# EAGLE design Stethoscope v1.0 (EAGLE 7.7.0)
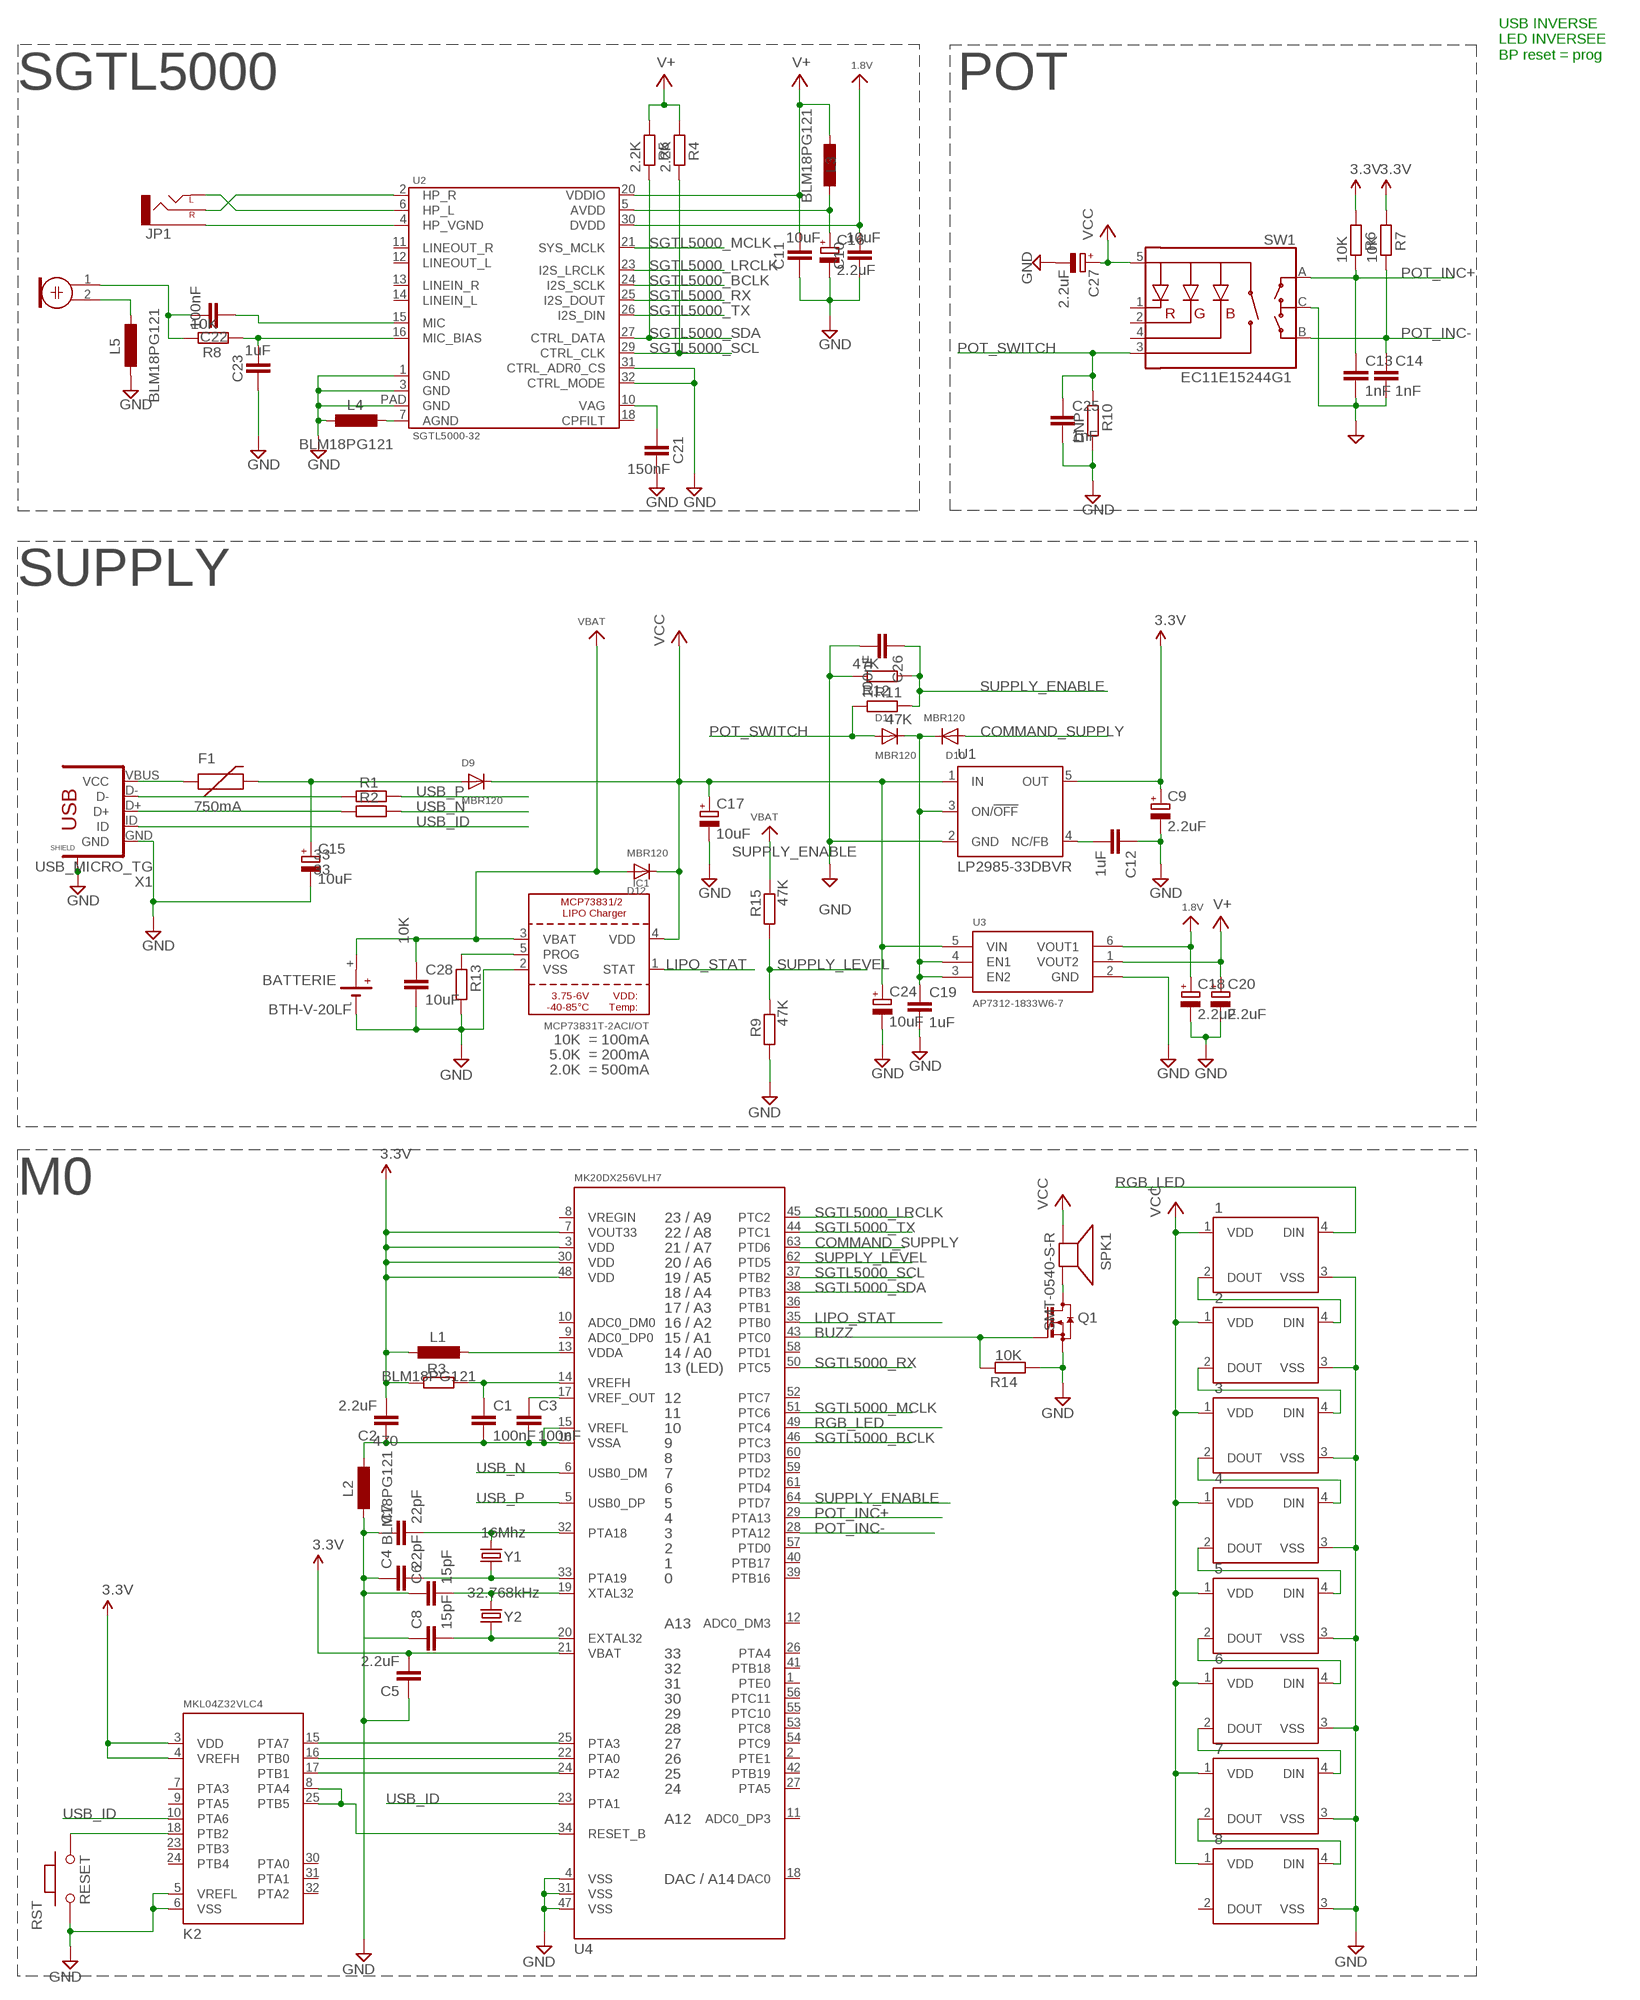
[diagram p0: schematic, sheet 1]

## Parts
1  WS2812B  [WS2812B]
2  WS2812B  [WS2812B]
3  WS2812B  [WS2812B]
4  WS2812B  [WS2812B]
5  WS2812B  [WS2812B]
6  WS2812B  [WS2812B]
7  WS2812B  [WS2812B]
8  WS2812B  [WS2812B]
BATTERIE  BTH-V-20LF  B1  [3V_BAT_HOLDER]
C1  100nF  C-EUC0603  [C0603]
C2  2.2uF  C-EUC0603  [C0603]
C3  100nF  C-EUC0603  [C0603]
C4  22pF  C-EUC0603  [C0603]
C5  2.2uF  C-EUC0603  [C0603]
C6  15pF  C-EUC0603  [C0603]
C7  22pF  C-EUC0603  [C0603]
C8  15pF  C-EUC0603  [C0603]
C9  2.2uF  CPOL-EUC0805POL  [C0805POL]
C10  10uF  C-EUC0805  [C0805]
C11  10uF  C-EUC0805  [C0805]
C12  1uF  C-EUC0603  [C0603]
C13  1nF  C-EUC0603  [C0603]
C14  1nF  C-EUC0603  [C0603]
C15  10uF  CPOL-EUC0805POL  [C0805POL]
C16  2.2uF  CPOL-EUC0805POL  [C0805POL]
C17  10uF  CPOL-EUC0805POL  [C0805POL]
C18  2.2uF  CPOL-EUC0805POL  [C0805POL]
C19  1uF  C-EUC0603  [C0603]
C20  2.2uF  CPOL-EUC0805POL  [C0805POL]
C21  150nF  C-EUC0805  [C0805]
C22  100nF  C-EUC0805  [C0805]
C23  1uF  C-EUC0805  [C0805]
C24  10uF  CPOL-EUC0805POL  [C0805POL]
C25  1nF  C-EUC0603  [C0603]
C26  100nF  C-EUC0603  [C0603]
C27  2.2uF  CPOL-EUC0805POL  [C0805POL]
C28  10uF  C-EUC1206  [C1206]
D9  MBR120  DIODESOD-323F  [SOD-323F]
D10  MBR120  DIODESOD-323F  [SOD-323F]
D11  MBR120  DIODESOD-323F  [SOD-323F]
D12  MBR120  DIODESOD-323F  [SOD-323F]
F1  750mA  PTC0603  [0603]
IC1  MCP73831T-2ACI/OT  MCP73831/2  [SOT23-5]
JP1  AUDIO-JACK1:1  [STEREOJACK2.5MM]
K2  MKL04Z32VLC4  [LQFP32-08]
L1  BLM18PG121  L-EUL0603  [L0603]
L2  BLM18PG121  L-EUL0603  [L0603]
L3  BLM18PG121  L-EUL0603  [L0603]
L4  BLM18PG121  L-EUL0603  [L0603]
L5  BLM18PG121  L-EUL0603  [L0603]
M1  ELECTRET_MICROPHON-F6050AP  [F6050AP]
Q1  BSS123  [SOT23]
R1  33  R-EU_R0603  [R0603]
R2  33  R-EU_R0603  [R0603]
R3  470  R-EU_R0603  [R0603]
R4  2.2K  R-EU_R0603  [R0603]
R5  2.2K  R-EU_R0603  [R0603]
R6  10K  R-EU_R0603  [R0603]
R7  10K  R-EU_R0603  [R0603]
R8  10K  R-EU_R0603  [R0603]
R9  47K  R-EU_R0603  [R0603]
R10  DNP  R-EU_R0603  [R0603]
R11  47K  R-EU_R0603  [R0603]
R12  47K  R-EU_R0603  [R0603]
R13  10K  R-EU_R0603  [R0603]
R14  10K  R-EU_R0603  [R0603]
R15  47K  R-EU_R0603  [R0603]
RST  RESET  PB157  [157SW]
SPK1  SMT-0540-S-R  [SMT-0540-S-R]
SW1  EC11E15244G1  ENCODER_RGB_CAKIT  [ENCODER_LED_3_KIT]
U1  LP2985-33DBVR  LP2985-XXDBVR33  [SOT23-DBV]
U2  SGTL5000-32  [QFN-32-5MM]
U3  AP7312-1833W6-7  VREG_SOT23-6_DUALAP7312  [SOT23-6]
U4  MK20DX256VLH7  [LQFP64-05]
X1  USB_MICRO_TG  [USB_MICRO_TG]
Y1  16Mhz  CRYSTAL3.2X1.5MM  [CRYSTAL-SMD-3.2X1.5MM]
Y2  32.768kHz  CRYSTAL3.2X1.5MM  [CRYSTAL-SMD-3.2X1.5MM]

## Nets
1.8V: C10.2 C18.SMD+(+) U2.30(DVDD) U3.6(VOUT1)
3.3V: C2.2 C5.2 C9.SMD+(+) K2.3(VDD) K2.4(VREFH) L1.2 R3.2 R6.2 R7.2 U1.5(OUT) U4.3(VDD) U4.7(VOUT33) U4.21(VBAT) U4.30(VDD) U4.48(VDD)
BUZZ: Q1.1(G) R14.2 U4.43(PTC0)
COMMAND_SUPPLY: D10.A U4.63(PTD6)
COMMAND_SUPPLY2: C19.1 D10.C D11.C U1.3(ON/!OFF) U3.3(EN2) U3.4(EN1)
GND: 1.3(VSS) 2.3(VSS) 3.3(VSS) 4.3(VSS) 5.3(VSS) 6.3(VSS) 7.3(VSS) 8.3(VSS) BATTERIE.- C4.1 C5.1 C6.1 C7.1 C8.1 C9.SMD-(-) C10.1 C11.1 C12.1 C13.2 C14.2 C15.SMD-(-) C16.SMD-(-) C17.SMD-(-) C18.SMD-(-) C19.2 C20.SMD-(-) C21.2 C23.1 C24.SMD-(-) C25.2 C26.2 C27.SMD-(-) C28.2 IC1.2(VSS) K2.5(VREFL) K2.6(VSS) L2.2 L4.2 L5.2 Q1.2(S) R9.1 R10.1 R12.2 R13.1 R14.1 RST.1 SW1.C U1.2(GND) U2.1(GND) U2.3(GND) U2.31(CTRL_ADR0_CS) U2.32(CTRL_MODE) U2.PAD(GND) U3.2(GND) U4.4(VSS) U4.31(VSS) U4.47(VSS) X1.GND X1.SHIELD X1.SHIELD2(SHIELD1) X1.SHIELD3(SHIELD2) X1.SHIELD4(SHIELD3) X1.SHIELD5(SHIELD4) X1.SHIELD6(SHIELD5) X1.SHIELD7(SHIELD6) X1.SHIELD8(SHIELD7)
LIPO_STAT: IC1.1(STAT) U4.35(PTB0)
N$1: C16.SMD+(+) L3.1 U2.5(AVDD)
N$2: L1.1 U4.13(VDDA)
N$3: K2.8(PTA4) K2.25(PTB5) U4.34(RESET_B)
N$4: C21.1 U2.10(VAG)
N$5: C6.2 U4.19(XTAL32) Y2.P$2
N$6: C15.SMD+(+) D9.A F1.2
N$7: C23.2 R8.2 U2.16(MIC_BIAS)
N$8: C22.1 U2.15(MIC)
N$9: JP1.5(SLEEVE) U2.4(HP_VGND)
N$10: JP1.1(LEFT) U2.6(HP_L)
N$11: JP1.4(RIGHT) U2.2(HP_R)
N$13: C8.2 U4.20(EXTAL32) Y2.P$1
N$14: C22.2 M1.1 R8.1
N$15: R1.2 X1.D-
N$16: R2.2 X1.D+
N$17: L5.1 M1.2
N$19: IC1.5(PROG) R13.2
N$20: L4.1 U2.7(AGND)
N$21: C12.2 U1.4(NC/FB)
N$22: C7.2 U4.32(PTA18) Y1.P$2
N$23: C4.2 U4.33(PTA19) Y1.P$1
N$24 [usbvcc]: F1.1 X1.VBUS(VCC)
N$26: C1.1 R3.1 U4.14(VREFH)
N$28: C1.2 C2.1 C3.2 L2.1 U4.15(VREFL) U4.16(VSSA)
N$29: C3.1 U4.17(VREF_OUT)
N$30: K2.15(PTA7) U4.25(PTA3)
N$31: K2.16(PTB0) U4.22(PTA0)
N$32: K2.17(PTB1) U4.24(PTA2)
N$34: K2.18(PTB2) RST.2
N$36: 2.2(DOUT) 3.4(DIN)
N$37: 3.2(DOUT) 4.4(DIN)
N$38: 4.2(DOUT) 5.4(DIN)
N$41: 5.2(DOUT) 6.4(DIN)
N$42: 6.2(DOUT) 7.4(DIN)
N$44: Q1.3(D) SPK1.+(-)
N$46: 7.2(DOUT) 8.4(DIN)
N$270: 1.2(DOUT) 2.4(DIN)
POT_INC+: C13.1 R6.1 SW1.A U4.29(PTA13)
POT_INC-: C14.1 R7.1 SW1.B U4.28(PTA12)
POT_SWITCH: C25.1 D11.A R10.2 R11.1 SW1.3(SW)
RGB_LED: 1.4(DIN) U4.49(PTC4)
SGTL5000_BCLK: U2.24(I2S_SCLK) U4.46(PTC3)
SGTL5000_LRCLK: U2.23(I2S_LRCLK) U4.45(PTC2)
SGTL5000_MCLK: U2.21(SYS_MCLK) U4.51(PTC6)
SGTL5000_RX: U2.25(I2S_DOUT) U4.50(PTC5)
SGTL5000_SCL: R4.1 U2.29(CTRL_CLK) U4.37(PTB2)
SGTL5000_SDA: R5.1 U2.27(CTRL_DATA) U4.38(PTB3)
SGTL5000_TX: U2.26(I2S_DIN) U4.44(PTC1)
SUPPLY_ENABLE: C26.1 R11.2 R12.1 U4.64(PTD7)
SUPPLY_LEVEL: R9.2 R15.1 U4.62(PTD5)
USB_ID: K2.10(PTA6) U4.23(PTA1) X1.ID
USB_N: R2.1 U4.6(USB0_DM)
USB_P: R1.1 U4.5(USB0_DP)
V+: C11.2 C20.SMD+(+) L3.2 R4.2 R5.2 U2.20(VDDIO) U3.1(VOUT2)
VBAT: BATTERIE.+ C28.1 D12.A IC1.3(VBAT) R15.2
VCC: 1.1(VDD) 2.1(VDD) 3.1(VDD) 4.1(VDD) 5.1(VDD) 6.1(VDD) 7.1(VDD) 8.1(VDD) C17.SMD+(+) C24.SMD+(+) C27.SMD+(+) D9.C D12.C IC1.4(VDD) SPK1.-(+) SW1.5(+) U1.1(IN) U3.5(VIN)
Unconnected: 8.2(DOUT) BATTERIE.1+(+) K2.7(PTA3) K2.9(PTA5) K2.23(PTB3) K2.24(PTB4) K2.30(PTA0) K2.31(PTA1) K2.32(PTA2) SW1.1(-R) SW1.2(-G) SW1.4(-B) U2.11(LINEOUT_R) U2.12(LINEOUT_L) U2.13(LINEIN_R) U2.14(LINEIN_L) U2.18(CPFILT) U4.1(PTE0) U4.2(PTE1) U4.8(VREGIN) U4.9(ADC0_DP0) U4.10(ADC0_DM0) U4.11(ADC0_DP3) U4.12(ADC0_DM3) U4.18(DAC0) U4.26(PTA4) U4.27(PTA5) U4.36(PTB1) U4.39(PTB16) U4.40(PTB17) U4.41(PTB18) U4.42(PTB19) U4.52(PTC7) U4.53(PTC8) U4.54(PTC9) U4.55(PTC10) U4.56(PTC11) U4.57(PTD0) U4.58(PTD1) U4.59(PTD2) U4.60(PTD3) U4.61(PTD4)

## Notes on the sheet
- USB INVERSE
  LED INVERSEE
  BP reset = prog
- SGTL5000 | POT
- SUPPLY
- 10K  = 100mA
- 5.0K  = 200mA
- 2.0K  = 500mA
- M0
- 23 / A9
- 22 / A8
- 21 / A7
- 20 / A6
- 19 / A5
- 18 / A4
- 17 / A3
- 16 / A2
- 15 / A1
- 14 / A0
- 13 (LED)
- 12
- 11
- 10
- 9
- 8
- 7
- 6
- 5
- 4
- 3
- 2
- 1
- 0
- A13
- 33
- 32
- 31
- 30
- 29
- 28
- 27
- 26
- 25
- 24
- A12
- DAC / A14

## Library data of the parts
1-8 = SparkFun-LED:WS2812B: WS2812B - Intelligent control LED integrated light source Technical Specifications: Power Supply Voltage (VDD): 3.5 to 5.3 V Input Voltage (VI): -0.5 to VDD+0.5 V Operating Junction Temperature (Topt): -25°C to +80°C Storage Temperature Range (Tstg): -55°C to +150°C
BATTERIE = DOUBLE-SIDE:B: LI BATTERY Varta
C1-C8 C10-C14 C19 C21-C23 C25 C26 = rcl:C-EU: CAPACITOR, European symbol
C9 C15-C18 C20 C24 C27 = rcl:CPOL-EU: POLARIZED CAPACITOR, European symbol
C28 = resistor:C-EU: CAPACITOR, European symbol
D9-D12 = adafruit:DIODE: Diode SMADIODE - SMA Surface Mount Package 20V 1A Schottky Diode Digikey: 641-1014-6-ND DO-1N4148 - Through Hole Small Current Diode SOD-123 20V 1 A (.5mV Vf) Schottky Diode - Digikey: MBRX120TPMSCT-ND SOD-323 10V 570mA (.38mV Vf, 3ns) Schottky Diode - Digikey: ZLLS410CT-ND SOD-523 30V 30mA Schottky Diode (RB751S-40TE61) - Digikey: RB751S-40TE61CT-ND SOT23-R/W - SOT23 Package (R = Solder Paste/Reflow Ovens, W = Hand-Soldering) BAT54Film 40V 300mA - Digikey: 497-7162-1-ND
F1 = SparkFun-PowerIC:PTC: Resettable Fuse PTC Resettable Fuse. Spark Fun Electronics SKU : COM-08357
IC1 = microbuilder:MCP73831/2: MCP73831/2 LIPO Charger VDD: 3.75 - 6V Temp -40 - 85°C Programmable Charge Rate: 15-500mA NOTE: STAT is a tri-state logic output on the MCP73831 and an open-drain output on the MCP73832. SOT23-5 with 4.2V output and tri-state logic on STAT = MCP73831T-2ACI/OT
JP1 = SparkFun-Connectors:AUDIO-JACK: 3.5mm Audio Jack Simple 3.5mm common PCB mount audio jack. Variant PTH is our storefront SKU PRT-08032
K2 = t32_ref:MKL04Z32VLC4; DESC: MKL04Z32VLC4 (preprogrammed); MF: PJRC; MPN: IC_MKL04Z32_TQFP32; PACKAGE: LQFP-32; TYPE: Microcontroller
L1-L5 = rcl-2:L-EU: INDUCTOR, European symbol
M1 = microphon:ELECTRET_MICROPHON-: Electret Condenser Microphone
Q1 = transistor-small-signal:BSS123: N-CHANNEL MOS FET
R1-R3 R9 R11-R13 R15 = resistor:R-EU_: RESISTOR, European symbol
R4-R8 R10 R14 = rcl:R-EU_: RESISTOR, European symbol
RST = MySMD:PB157
SPK1 = adafruit:SMT-0540-S-R: SMT-0549-S-R Small surface-mount magnetic buzzer
SW1 = SparkFun-Electromechanical:ENCODER_RGB_CA: Illuminated Rotary Encoder w/ RGB LED and select switch EC12PLRGBSDVBF-D: http://top-up.so-buy.com/front/bin/ptdetail.phtml?Part=EC12PLRGBSDVBF-D
U1 = SmartPrj:LP2985-XXDBVR: ULTRALOW-POWER 50-mA LOW-DROPOUT LINEAR REGULATORS 50-mA Low-Dropout Regulator Source: http://focus.ti.com/lit/ds/symlink/tps77001.pdf
U2 = Freescale:SGTL5000-32
U3 = microbuilder:VREG_SOT23-6_DUAL: Dual Output SOT23-6 Linear Regulators Diodes Inc. AP7312 - Dual 150mA LDO Linear Regulator 0.2V dropout, 150mA output, 2-6V Input AP7312-1833W6-7 - 1.8V/3.3V SOT23-6 (Digikey: AP7312-1833W6-7DICT-ND) MIC5320 - Dual 150mA ULDO Linear Regulator Ultra-low 35mV dropout at 150mA, 2.3-5.5V Input 3.3V/1.8V SOT23-6 (Digikey: 576-1658-1-ND) 3.3V/1.5V SOT23-6 (Digikey: 576-3483-1-ND)
U4 = t32_ref:MK20DX256VLH7; DESC: MK20DX256VLH7; MF: NXP; MPN: MK20DX256VLH7; OC_MOUSER: 841-MK20DX256VLH7; PACKAGE: LQFP-64; TYPE: Microcontroller
X1 = CIC-IT:USB_MICRO_TG
Y1 Y2 = samd21-temp:CRYSTAL: Various standard crystals. Proven footprints.; PROD_ID: XTAL-13062

## Net classes
1 Power: width 0.254 mm, clearance 0.152 mm
2 gnd: width 0.305 mm, drill 0.559 mm, clearance 0.254 mm
3 usbvcc: width 0.254 mm, drill 0.254 mm, clearance 0.203 mm

## Board
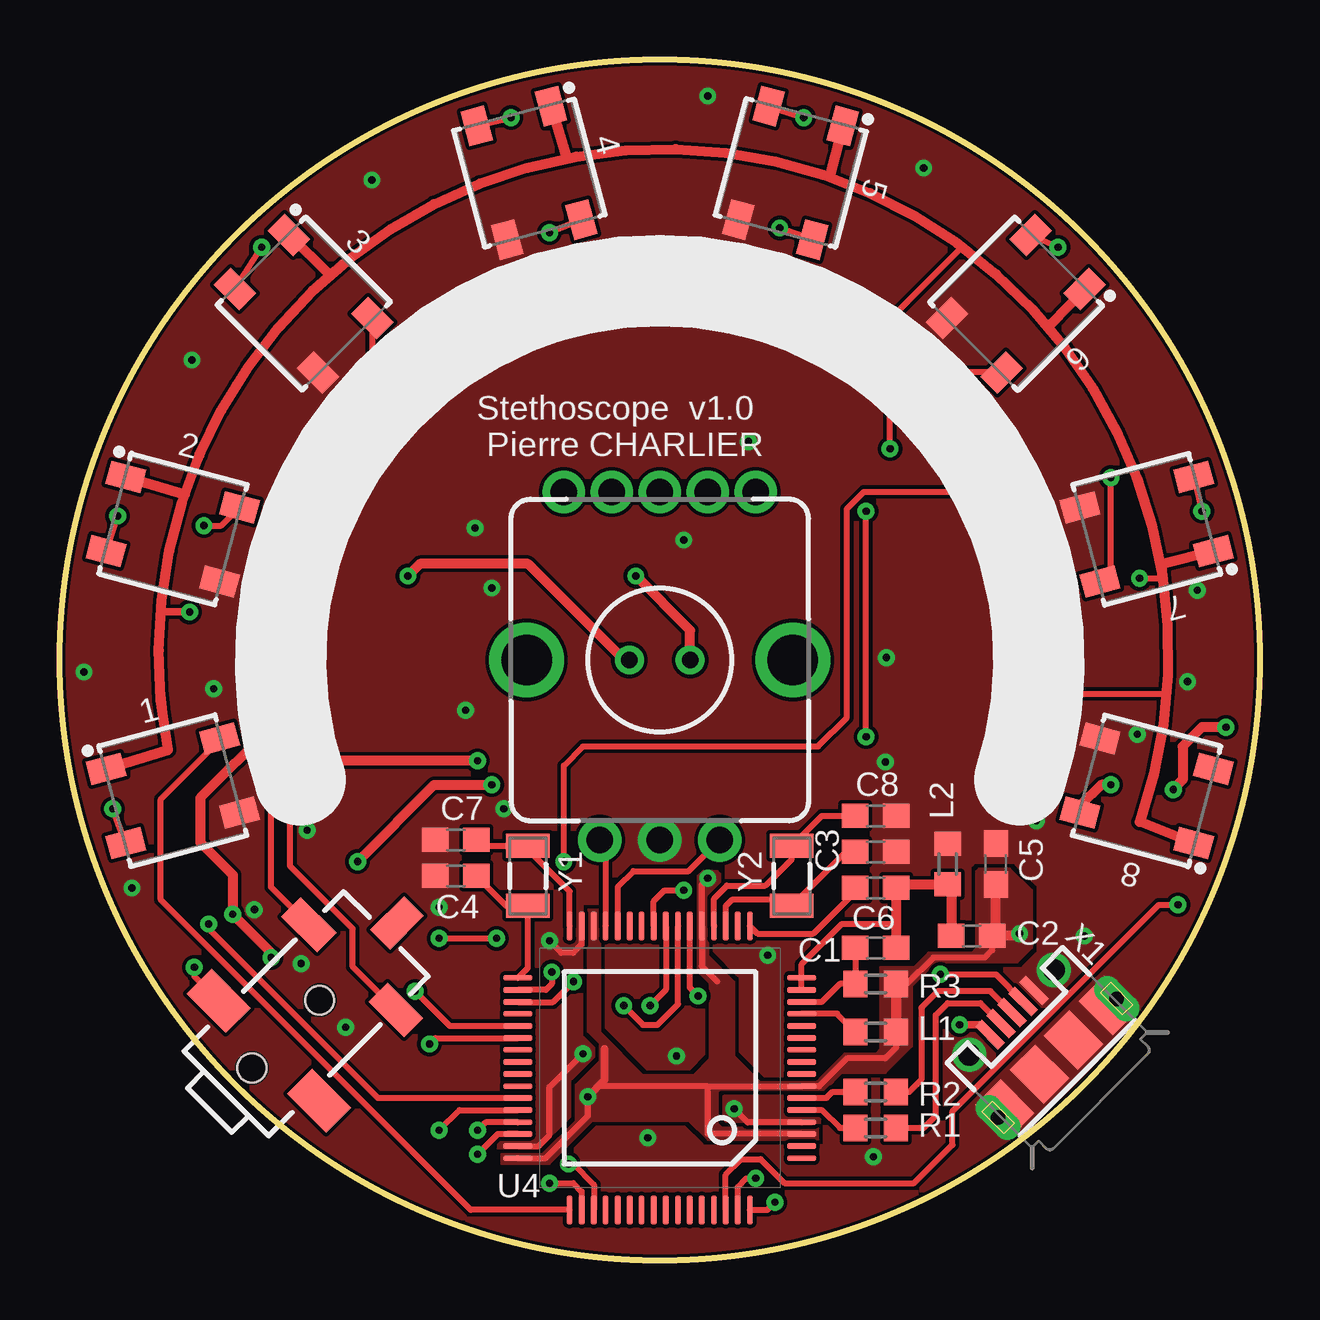
[diagram p1: board, top side]
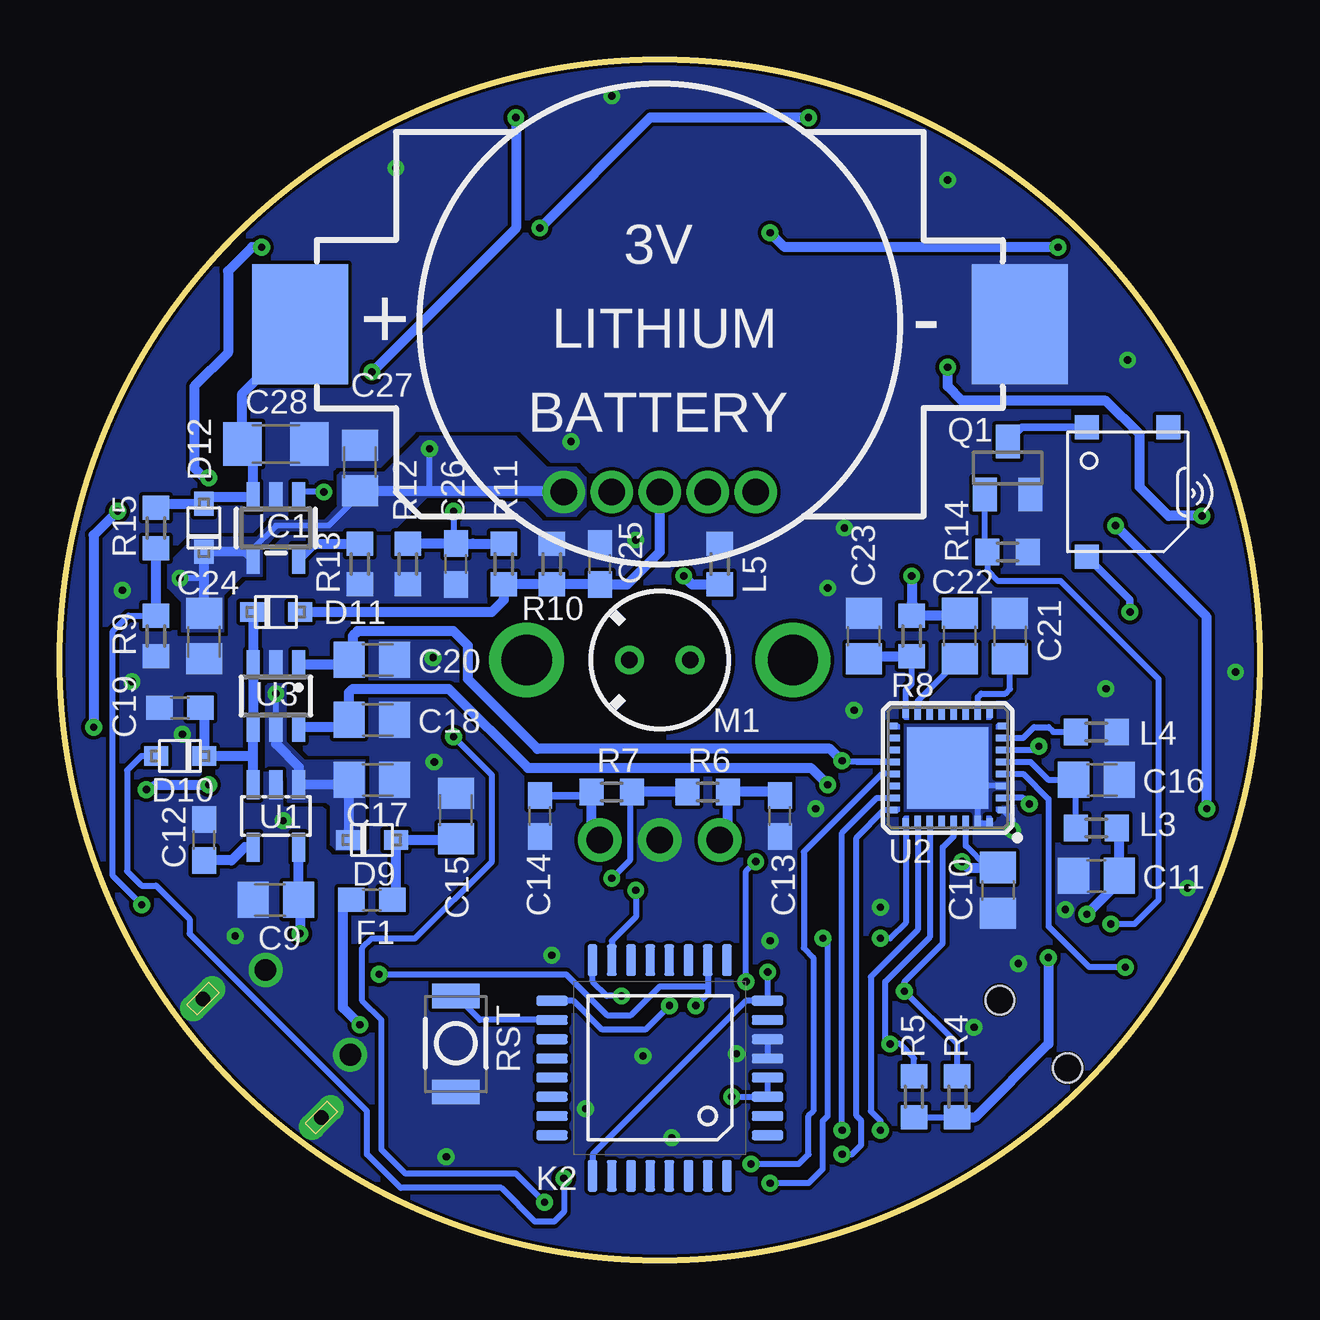
[diagram p2: board, bottom side, seen from below]

Size 50 x 50 mm. Coordinates in mm from the lower left corner, seen from the top.
Outline: circle at 25,25 radius 25
Copper layers (1*16): Top 0.035mm / dielectric 1.5mm / Bottom 0.035mm
Design rules "default *": minimum track width 0.2mm, minimum drill 0.3mm, track to track 6mil, track to pad 6mil, pad to pad 6mil, via to via 8mil, smd to smd 4mil, copper to edge 0.1mm, drill to drill 0.2mm, minimum pad ring 10mil, minimum via ring 8mil, stop-mask expansion 4mil, vias tented up to drill 20mil, thermal gap 10mil

### Footprints (pad centres in the part's own frame; a part is rotated, then mirrored left to right if it is on the bottom)
WS2812B = smd 1.5 x 1: 1 -2.45,1.6; 2 -2.45,-1.6; 3 2.45,-1.6; 4 2.45,1.6
3V_BAT_HOLDER = smd 2 x 2: 1+ -15,0 | smd 4 x 5: + -15,0; - 15,0
C0603 = smd 1.1 x 1: 1 -0.85,0; 2 0.85,0
C0805POL = smd 1.3 x 1.5: SMD+ -0.95,0; SMD- 0.95,0
C0805 = smd 1.3 x 1.5: 1 -0.95,0; 2 0.95,0
C1206 = smd 1.6 x 1.8: 1 -1.4,0; 2 1.4,0
SOD-323F = smd 1 x 0.8: A -1,0; C 1,0
0603 = smd 1.1 x 1: 1 -0.85,0; 2 0.85,0
SOT23-5 = smd 0.55 x 1.2: 1 -0.95,-1.3; 2 0,-1.3; 3 0.95,-1.3; 4 0.95,1.3; 5 -0.95,1.3
STEREOJACK2.5MM = smd 1.144 x 2.1: 1 5.898,2.54 | smd 1.998 x 1.17: 3 8.55,0 | smd 1.119 x 2.1: 4 5.949,-2.54 | smd 1.467 x 2.3: 5 1,2.952; A 1.016,-2.952 | hole 1.2: 0,0; 4,0
LQFP32-08 = smd 1.3 x 0.4: 1 -4.493,2.8; 2 -4.493,2; 3 -4.493,1.2; 4 -4.493,0.4; 5 -4.493,-0.4; 6 -4.493,-1.2; 7 -4.493,-2; 8 -4.493,-2.8; 17 4.493,-2.8; 18 4.493,-2; 19 4.493,-1.2; 20 4.493,-0.4; 21 4.493,0.4; 22 4.493,1.2; 23 4.493,2; 24 4.493,2.8 | smd 0.4 x 1.3: 9 -2.8,-4.493; 10 -2,-4.493; 11 -1.2,-4.493; 12 -0.4,-4.493; 13 0.4,-4.493; 14 1.2,-4.493; 15 2,-4.493; 16 2.8,-4.493; 25 2.8,4.493; 26 2,4.493; 27 1.2,4.493; 28 0.4,4.493; 29 -0.4,4.493; 30 -1.2,4.493; 31 -2,4.493; 32 -2.8,4.493
L0603 = smd 1 x 1.1: 1 -0.85,0; 2 0.85,0
F6050AP = drill 0.7 pad 1.2: 1 0,1.27; 2 0,-1.27
SOT23 = smd 1 x 1.4: 1 -0.95,-1.1; 2 0.95,-1.1; 3 0,1.1
R0603 = smd 1 x 1.1: 1 -0.85,0; 2 0.85,0
157SW = smd 1.016 x 1.981: 1 0,0; 2 4,0
SMT-0540-S-R = smd 1 x 1: + 1.7,-2.7; - 1.7,2.7; M -1.7,-2.7
ENCODER_LED_3_KIT = drill 1.1 pad 1.778: 1 -4,7; 2 -2,7; 3 0,7; 4 2,7; 5 4,7 | drill 1.1 pad 1.8: A -2.5,-7.5; B 2.5,-7.5; C 0,-7.5 | drill 2.1: M1 -5.55,0; M2 5.55,0
SOT23-DBV = smd 0.55 x 1.2: 1 -0.95,-1.3; 2 0,-1.3; 3 0.95,-1.3; 4 0.95,1.3; 5 -0.95,1.3
QFN-32-5MM = smd 0.4 x 0.29: 1 -2.3,1.75; 8 -2.3,-1.75; 17 2.3,-1.75; 24 2.3,1.75 | smd 0.5 x 0.29: 2 -2.25,1.25; 3 -2.25,0.75; 4 -2.25,0.25; 5 -2.25,-0.25; 6 -2.25,-0.75; 7 -2.25,-1.25; 18 2.25,-1.25; 19 2.25,-0.75; 20 2.25,-0.25; 21 2.25,0.25; 22 2.25,0.75; 23 2.25,1.25 | smd 0.29 x 0.4: 9 -1.75,-2.3; 16 1.75,-2.3; 25 1.75,2.3; 32 -1.75,2.3 | smd 0.29 x 0.5: 10 -1.25,-2.25; 11 -0.75,-2.25; 12 -0.25,-2.25; 13 0.25,-2.25; 14 0.75,-2.25; 15 1.25,-2.25; 26 1.25,2.25; 27 0.75,2.25; 28 0.25,2.25; 29 -0.25,2.25; 30 -0.75,2.25; 31 -1.25,2.25 | smd 3.4 x 3.4: PAD 0,0
SOT23-6 = smd 0.55 x 1.2: 1 -0.95,-1.3; 2 0,-1.3; 3 0.95,-1.3; 4 0.95,1.3; 5 0,1.3; 6 -0.95,1.3
LQFP64-05 = smd 1.2 x 0.25: 1 -5.915,3.759; 2 -5.915,3.251; 3 -5.915,2.743; 4 -5.915,2.261; 5 -5.915,1.753; 6 -5.915,1.245; 7 -5.915,0.762; 8 -5.915,0.254; 9 -5.915,-0.254; 10 -5.915,-0.762; 11 -5.915,-1.245; 12 -5.915,-1.753; 13 -5.915,-2.261; 14 -5.915,-2.743; 15 -5.915,-3.251; 16 -5.915,-3.759; 33 5.915,-3.759; 34 5.915,-3.251; 35 5.915,-2.743; 36 5.915,-2.261; 37 5.915,-1.753; 38 5.915,-1.245; 39 5.915,-0.762; 40 5.915,-0.254; 41 5.915,0.254; 42 5.915,0.762; 43 5.915,1.245; 44 5.915,1.753; 45 5.915,2.261; 46 5.915,2.743; 47 5.915,3.251; 48 5.915,3.759 | smd 0.25 x 1.2: 17 -3.759,-5.915; 18 -3.251,-5.915; 19 -2.743,-5.915; 20 -2.261,-5.915; 21 -1.753,-5.915; 22 -1.245,-5.915; 23 -0.762,-5.915; 24 -0.254,-5.915; 25 0.254,-5.915; 26 0.762,-5.915; 27 1.245,-5.915; 28 1.753,-5.915; 29 2.261,-5.915; 30 2.743,-5.915; 31 3.251,-5.915; 32 3.759,-5.915; 49 3.759,5.915; 50 3.251,5.915; 51 2.743,5.915; 52 2.261,5.915; 53 1.753,5.915; 54 1.245,5.915; 55 0.762,5.915; 56 0.254,5.915; 57 -0.254,5.915; 58 -0.762,5.915; 59 -1.245,5.915; 60 -1.753,5.915; 61 -2.261,5.915; 62 -2.743,5.915; 63 -3.251,5.915; 64 -3.759,5.915
USB_MICRO_TG = smd 1.35 x 0.4: D+ 1.148,0.006; D- 1.148,0.656; GND 1.148,-1.294; ID 1.148,-0.644; VBUS 1.148,1.306 | smd 2 x 1.5: SHIELD -1.482,3.056; SHIELD2 -1.482,1.006; SHIELD3 -1.482,-1.004; SHIELD4 -1.482,-3.044 | drill 0.6 pad 0.95 long: SHIELD5 -1.532,3.506; SHIELD6 -1.532,-3.484 | drill 0.9 pad 1.422: SHIELD7 1.168,2.506; SHIELD8 1.171,-2.486
CRYSTAL-SMD-3.2X1.5MM = smd 1 x 1.8: P$1 -1.25,0; P$2 1.25,0

### Placement (x,y rotation side)
1  4.7,19.55 15 top
2  4.7,30.45 345 top
3  10.15,39.85 315 top
4  19.55,45.3 285 top
5  30.45,45.3 255 top
6  39.85,39.85 225 top
7  45.3,30.45 195 top
8  45.3,19.55 165 top
BATTERIE  25,39 0 bottom
C1  34,13 0 top
C2  38,13.5 0 top
C3  34,15.5 0 top
C4  16.5,16 0 top
C5  39,16.5 270 top
C6  34,17 180 top
C7  16.5,17.5 0 top
C8  34,18.5 180 top
C9  41,15 180 bottom
C10  10.9,15.4 90 bottom
C11  6.8,16 0 bottom
C12  44,17.5 270 bottom
C13  20,18.5 270 bottom
C14  30,18.5 270 bottom
C15  33.5,18.5 90 bottom
C16  6.8,20 0 bottom
C17  37,20 0 bottom
C18  37,22.5 0 bottom
C19  45,23 180 bottom
C20  37,25 0 bottom
C21  10.4,26 90 bottom
C22  12.5,26 90 bottom
C23  16.5,26 270 bottom
C24  44,26 270 bottom
C25  27.5,29 90 bottom
C26  33.5,29 270 bottom
C27  37.5,33 90 bottom
C28  41,34 0 bottom
D9  37,17.5 180 bottom
D10  45,21 0 bottom
D11  41,27 180 bottom
D12  44,30.5 270 bottom
F1  37,15 0 bottom
IC1  41,30.5 180 bottom
JP1  8,8 45 top
K2  25,8 180 bottom
L1  34,9.5 0 top
L2  37,16.5 90 top
L3  6.8,18 0 bottom
L4  6.8,22 0 bottom
L5  22.5,29 90 bottom
M1  25,25 270 bottom
Q1  10.5,33 0 bottom
R1  34,5.5 0 top
R2  34,7 0 top
R3  34,11.5 0 top
R4  12.6,6.8 270 bottom
R5  14.4,6.8 270 bottom
R6  23,19.5 180 bottom
R7  27,19.5 0 bottom
R8  14.5,26 270 bottom
R9  46,26 90 bottom
R10  29.5,29 270 bottom
R11  31.5,29 90 bottom
R12  35.5,29 270 bottom
R13  37.5,29 90 bottom
R14  10.5,29.5 180 bottom
R15  46,30.5 90 bottom
RST  33.5,7 90 bottom
SPK1  5.5,32 180 bottom
SW1  25,25 0 top
U1  41,18.5 180 bottom
U2  13,20.5 180 bottom
U3  41,23.5 180 bottom
U4  25,8 180 top
X1  40.5,9.5 135 top
Y1  19.5,16 90 top
Y2  30.5,16 270 top

### Tracks (layer width: path | path; a pad name or v marks a point on that pad's centre or on a via)
1.8V  (via drill 0.3)
  Top 0.406: v12.4,16.6 15.6,19.8 v18,19.8
  Bottom 0.254: C10.2 11.35,16.35 12.25,17.25 U2.30
  Bottom 0.406: U3.6 38.25,22.2 C18.SMD+ 37.95,23.65 37.8,23.8 33.8,23.8 30.5,20.5 18.7,20.5 v18,19.8 | v12.4,16.6 12.15,16.35 C10.2
3.3V  (via drill 0.3)
  Top 0.254: U4.48 20.24,4.24 22,6 v22,6.8 | 22.26,7.06 v22,6.8 | U4.3 27,5.26 27,7.24 | 27,7.24 U4.7 31.64,7.24 32.8,8.4 34.4,8.4 34.85,8.85 L1.2 | 27,7.24 22.44,7.24 v22,6.8 | 39,13.65 C2.2 38.85,12.9 38.55,12.6 36.4,12.6 35.3,11.5 R3.2 | 27.4,11.6 26.75,12.25 U4.21 26.75,15.65 v27,15.9
  Top 0.305: 22.7,8.8 22.7,7.5 v22,6.8
  Top 0.406: R3.2 L1.2 | 39,13.65 C5.2 | v40,13.6 39.9,13.5 C2.2
  Bottom 0.254: v22,6.8 K2.3 K2.4 | C9.SMD+ 40,14.95 | v27,15.9 26.25,16.65 26.25,19.4 | 26.25,19.5 26.25,19.4 | R7.2 26.25,19.4
  Bottom 0.406: C9.SMD+ U1.5 | R6.2 R7.2 | 40,14.95 v40,13.6
  pour Top (no thermals): 18.4,4 18.4,4.4 20.1,4.4 21.5,5.8 21.5,7.3 22.5,8.3 22.5,9 22,9.5 22,14.6 22.5,14.6 22.5,9.5 24.3,7.7 26.4,7.7 27.1,8.4 27.1,11.5 26.6,12 26.6,16 26.8,16.2 27.4,16.2 27.5,16.1 27.5,15.6 27,15.1 27,12.7 28.1,11.6 28.1,8.5 29.2,7.4 31.5,7.4 32.7,8.6 34,8.6 34.2,8.8 34.2,12.2 35.6,12.2 36.2,12.8 38,12.8 38.2,13 38.2,16.2 38.3,16.3 39.6,16.3 40.5,15.4 40.5,13 39.9,12.4 36.5,12.4 35.5,11.4 35.5,8.9 34.4,7.8 32.6,7.8 31.9,7.1 27.5,7.1 27.4,7 27.4,5.7 27.6,5.5 31.6,5.5 31.6,5 27,5 26.2,5.8 22.2,5.8 20.4,4
BUZZ  (via drill 0.3)
  Top 0.254: U4.43 13.25,6.75 6.2,13.8 v6.2,14
  Bottom 0.254: Q1.1 11.45,29.6 R14.2 11.35,28.75 10.9,28.3 8.3,28.3 4.2,24.2 4.2,15 5.2,14 v6.2,14
COMMAND_SUPPLY  (via drill 0.3)
  Top 0.254: U4.63 28.25,3.05 28.6,3.4 v29,3.4
  Bottom 0.254: v29,3.4 29,2 29.4,1.6 30.2,1.6 31.6,3 35.8,3 37.2,4.4 37.2,6.2 44.6,13.6 44.6,14.2 46,15.6 46.6,15.6 47.2,16.2 47.2,20.4 46.6,21 D10.A
COMMAND_SUPPLY2
  Bottom 0.406: U1.3 41.95,21 | 41.95,21 U3.4 U3.3 41.95,26.95 D11.C | 41.95,21 D10.C 44,22.85 C19.1
GND  (via drill 0.3)
  Top 0.254: U4.4 28.66,5.74 v28.1,6.3 | U4.47 19.95,4.75 20.4,5.2 20.4,7.2 v21.8,8.6 | U4.31 21.75,13.15 21.4,12.8 20.9,12.8 v20.4,13.3
  Bottom 0.254: U2.3 12.25,19.75 U2.PAD 11.75,19.25 U2.31 11.7,18.2 U2.32 | K2.6 K2.5 | U2.1 10.3,18.35 v10.3,17.9
  other vias: 18,28 26,30 15.8,14.7 18.5,18.8 47,24.1 47.4,27.9 44.9,21.9 34.4,20.75 34.45,25.1 6.4,23.8 10.05,12.35 8.1,14.6 13,45 36,45.5 5.5,37.5 27,48.5 1,24.5 3,15.5 33.9,4.3 25.7,8.5 29.5,12.7 42.7,13.5 40.7,18.3 28.7,34.1 17.3,30.5 16.9,22.9 11.9,9.7 24.5,5.1
  pour Top (rank 6, no thermals): 0,50 50,50 50,0 0,0
  pour Bottom (rank 6, no thermals): 50,50 0,50 0,0 50,0
LIPO_STAT  (via drill 0.3)
  Top 0.254: U4.35 20.54,10.74 v21.4,11.6 | v21,16.6 21,20.6 21.8,21.4 31.6,21.4 32.8,22.6 32.8,31.3 33.5,32 v39,32
  Bottom 0.254: v21.4,11.6 21.4,16.2 v21,16.6 | v39,32 39.85,32 IC1.1
N$1
  Bottom 0.254: U2.5 9.55,20.75 8.8,20 C16.SMD+ 7.65,19.9 L3.1
N$2
  Top 0.254: L1.1 32.39,10.26 U4.13
N$3  (via drill 0.3)
  Top 0.254: v20.5,12 20.5,11.5 20.25,11.25 U4.34
  Bottom 0.254: v20.5,12 K2.8 21.4,10.8 27.8,4.4 K2.25
N$4
  Bottom 0.254: U2.10 11.75,23.45 11.6,23.6 10.6,23.6 10.4,23.8 C21.1
N$5
  Top 0.254: U4.19 27.74,14.74 28,15 30.25,15 Y2.P$2 32.75,17 C6.2
N$6
  Bottom 0.406: F1.2 36,15 D9.A 33.5,17.5 C15.SMD+
N$7
  Bottom 0.254: U2.16 14.75,23.75 14.5,24 R8.2
  Bottom 0.406: C23.2 16.4,25.15 R8.2
N$8
  Bottom 0.254: C22.1 14.25,23.3 U2.15
N$9  (via drill 0.3)
  Top 0.254: 6.62,10.82 JP1.5 5.6,11.81 v5.6,12.2
  Bottom 0.254: U2.4 9.85,20.25 8.8,19.2 8.8,13.9 7.1,12.2 v5.6,12.2
N$10  (via drill 0.3)
  Top 0.254: JP1.1 8.8,15.54 8.8,19.4 9.2,19.8 v9.2,21.4
  Bottom 0.254: U2.6 9.35,21.25 v9.2,21.4
N$11  (via drill 0.3)
  Top 0.254: JP1.4 12.2,12.21 12.2,13.8 9.6,16.4 v9.6,19
  Bottom 0.254: v9.6,19 9.85,19.25 U2.2
N$13
  Top 0.254: U4.20 27.26,15.06 27.8,15.6 29.4,15.6 30.5,16.7 Y2.P$1 31.75,18.5 C8.2
N$14  (via drill 0.3)
  Top 0.406: M1.1 23.5,25 19.5,29 15,29 v14.5,28.5
  Bottom 0.406: C22.2 12.6,26.85 14,26.85 | 14,26.85 R8.1 | v14.5,28.5 14.5,27.35 14,26.85
N$15
  Top 0.254: R1.2 36,5.5 36.5,6 36.5,10.2 37,10.7 38.37,10.7 X1.D-
N$16
  Top 0.254: X1.D+ 38.79,11.2 36.6,11.2 35.9,10.5 35.9,7.5 35.4,7 R2.2
N$17  (via drill 0.3)
  Top 0.406: M1.2 26.27,26.23 v24,28.5
  Bottom 0.406: v24,28.5 23.65,28.15 L5.1
N$19
  Bottom 0.406: IC1.5 39.4,29.85 R13.2
N$20
  Bottom 0.254: U2.7 9.85,21.75 9.4,22.2 8.8,22.2 8.6,22 L4.1
N$21
  Bottom 0.406: U1.4 42.3,17.2 42.85,16.65 C12.2
N$22
  Top 0.254: U4.32 21.24,15.36 19.5,17.1 Y1.P$2 17.6,17.25 C7.2
N$23
  Top 0.254: U4.33 19.5,12.17 Y1.P$1 18.6,14.75 C4.2
N$24  (via drill 0.3)
  Top 0.305: X1.VBUS 38.35,9.8 v37.5,9.8
  Bottom 0.406: v37.5,9.8 38.2,10.5 38.2,14.65 F1.1
N$26
  Top 0.254: U4.14 31.74,10.74 32.5,11.5 R3.1 C1.1
N$28
  Top 0.254: U4.15 U4.16 30.92,12.31 32.6,14 34.85,14 | C3.2 35,15.65 | L2.1 37.15,15.5
  Top 0.406: C3.2 34.85,14 C1.2 | 35,15.65 L2.1 | 37.15,15.5 C2.1
N$29
  Top 0.254: U4.17 29.07,13.6 31.4,13.6 33.15,15.35 C3.1
N$30  (via drill 0.3)
  Top 0.254: U4.25 24.75,14.95 25.2,15.4 v26,15.4
  Bottom 0.254: v26,15.4 26,14.3 27,13.3 K2.15
N$31  (via drill 0.3)
  Top 0.254: U4.22 26.25,11.35 v26.6,11
  Bottom 0.254: v26.6,11 27.2,11 27.8,11.6 K2.16
N$32  (via drill 0.3)
  Top 0.254: U4.24 25.25,11.25 v24.6,10.6
  Bottom 0.254: K2.17 28.6,10.8 27.4,9.6 25.6,9.6 v24.6,10.6
N$34
  Bottom 0.254: K2.18 32.5,10 RST.2
N$36  (via drill 0.3)
  Top 0.254: 2.2 v2.4,31 | 3.4 v13,37.2
  Bottom 0.406: v2.4,31 3.8,31 5,32.2 5,34.4 6.4,35.8 12.4,35.8 13,36.4 v13,37.2
N$37  (via drill 0.3)
  Top 0.254: 3.2 v8.4,42.2 | 4.4 v20.4,42.8
  Bottom 0.406: v8.4,42.2 19.8,42.2 v20.4,42.8
N$38  (via drill 0.3)
  Top 0.254: 4.2 v18.8,47.6 | 5.4 v30,43
  Bottom 0.406: v18.8,47.6 25.4,47.6 v30,43
N$41  (via drill 0.3)
  Top 0.254: 5.2 v31,47.6 | 6.4 v37,37
  Bottom 0.406: v31,47.6 31,43 v37,37
N$42  (via drill 0.3)
  Top 0.254: 6.2 v41.6,42.2 | 7.4 43.8,28.72 v43.8,32.6
  Bottom 0.406: v41.6,42.2 42,42.2 43,41.2 43,37.8 44.4,36.4 44.4,33 44,32.6 v43.8,32.6
N$44
  Bottom 0.305: Q1.3 9.9,34.7 SPK1.+
N$46  (via drill 0.3)
  Top 0.254: 7.2 v47.6,31.2
  Top 0.406: v48.6,22.2 47.6,22.2 46.8,21.4 46.8,20 v46.4,19.6 | v43.8,19.8 43.4,19.8 42.52,18.92 8.4
  Bottom 0.406: v47.6,31.2 48.6,30.2 v48.6,22.2 | v46.4,19.6 46,19.8 v43.8,19.8
N$270  (via drill 0.3)
  Top 0.254: v6,30.6 6.72,30.6 2.4 | 1.2 v2.2,18.8
  Bottom 0.406: v2.2,18.8 2.2,26.8 v6,30.6
POT_INC+
  Top 0.254: SW1.A 22.74,17.26 U4.29
  Bottom 0.406: SW1.A 22.15,17.85 R6.1 20.15,19.5 C13.1
POT_INC-
  Top 0.254: SW1.B 26.2,16.2 23.9,16.2 23.25,15.55 U4.28
  Bottom 0.305: 28,19.35 C14.1
  Bottom 0.406: SW1.B 27.85,17.85 R7.1 28,19.35
POT_SWITCH
  Bottom 0.406: D11.A 32,27 31.5,27.5 R11.1 R10.2 C25.1 26.35,28.15 25,29.5 SW1.3
RGB_LED
  Top 0.254: U4.49 17.12,2.08 4.2,15 4.2,19.2 6.65,21.65 1.4 6.13,21.73
SGTL5000_BCLK  (via drill 0.3)
  Top 0.254: 18.66,5.26 U4.46 18.26,5.26 v17.4,4.4
  Bottom 0.254: U2.24 15.65,18.75 16.8,17.6 16.8,6 16.6,5.8 16.6,4.8 17,4.4 v17.4,4.4
SGTL5000_LRCLK  (via drill 0.3)
  Top 0.254: U4.45 17.74,5.74 v17.4,5.4
  Bottom 0.254: U2.23 15.95,19.25 17.4,17.8 v17.4,5.4
SGTL5000_MCLK  (via drill 0.3)
  Top 0.254: U4.51 22.26,3.14 21.4,4 v21.2,4
  Bottom 0.254: U2.21 15.75,20.25 19,17 19,13 18.6,12.6 18.6,6.2 18.8,6 18.8,4.4 19.2,4 v21.2,4
SGTL5000_RX  (via drill 0.3)
  Top 0.254: v15.8,13.4 v18.2,13.4 | v20.4,3.2 21.4,3.2 21.75,2.85 U4.50
  Bottom 0.254: U2.25 14.75,14.05 15.4,13.4 v15.8,13.4 | v18.2,13.4 18,13.2 18,6 18.2,5.8 18.2,3.8 18.8,3.2 v20.4,3.2
SGTL5000_SCL  (via drill 0.3)
  Top 0.254: v14.8,11.2 16.25,9.75 U4.37
  Bottom 0.254: U2.29 12.75,17.65 13.2,17.2 13.2,13.2 14.8,11.6 v14.8,11.2 12.6,9 R4.1
SGTL5000_SDA  (via drill 0.3)
  Top 0.254: v15.4,9 15.64,9.24 U4.38
  Bottom 0.254: U2.27 13.75,13.45 15.6,11.6 15.6,9.2 v15.4,9 15,9 14.4,8.4 R5.1
SGTL5000_TX  (via drill 0.3)
  Top 0.254: v15.8,5.4 16.65,6.25 U4.44
  Bottom 0.254: U2.26 14.25,13.75 16.2,11.8 16.2,6.2 15.8,5.8 v15.8,5.4
SUPPLY_ENABLE  (via drill 0.3)
  Top 0.254: U4.64 29.48,2.08 v29.8,2.4 | v33.6,21.8 v33.6,31.2
  Bottom 0.254: v29.8,2.4 31,3.6 35.6,3.6 36.6,4.6 36.6,10 37.4,10.8 37.4,13 37,13.4 35.2,13.4 32,16.6 32,20.2 v33.6,21.8 | v33.6,31.2 33.6,30.05 32.8,29.85
  Bottom 0.406: R11.2 32.8,29.85 C26.1 R12.1
SUPPLY_LEVEL  (via drill 0.3)
  Top 0.254: U4.62 27.74,3.54 28.4,4.2 29.2,4.2 30.2,3.2 35.6,3.2 37.2,4.8 37.2,6.2 45.8,14.8 v46.6,14.8
  Bottom 0.254: v46.6,14.8 47.8,16 47.8,26.2 47.15,26.85 R9.2
  Bottom 0.406: R9.2 R15.1
USB_ID  (via drill 0.3)
  Top 0.254: U4.23 25.76,10.66 24.9,9.8 24.3,9.8 v23.5,10.6 | v36.7,11.9 39.01,11.9 X1.ID
  Bottom 0.254: K2.10 23,11.4 | 23,11.4 23,11.1 v23.5,10.6 | 23,11.4 25,11.4 26.2,10.2 27.2,10.2 28.9,11.9 v36.7,11.9
USB_N
  Top 0.254: U4.6 31.95,6.75 32.2,7 R2.1
USB_P
  Top 0.254: U4.5 31.75,6.25 32.5,5.5 R1.1
V+  (via drill 0.3)
  Top 0.406: v17.4,20.8 11.4,20.8 10,22.2 8.8,22.2 5.85,19.25 5.85,17.4 7.2,16.05 v7.2,14.4 8.8,12.8 v8.8,12.6
  Bottom 0.254: 16.8,20.75 U2.20 17.35,20.75 v17.4,20.8 | 5.85,18 L3.2 | R5.2 R4.2 | C11.2 5.85,15.75
  Bottom 0.406: U3.1 38.15,24.8 C20.SMD+ 37.8,25.15 37.8,26 37.6,26.2 33.6,26.2 33,25.6 33,24.2 30.1,21.3 17.9,21.3 v17.4,20.8 | C11.2 5.85,18 | R4.2 11.85,5.95 8.8,9 v8.8,12.6 | 5.85,15.75 v7.2,14.4
VBAT
  Bottom 0.406: R15.2 45.85,31.5 D12.A 43.7,31.8 IC1.3 41.95,33.55 C28.1 42.4,36.1 40,38.5 BATTERIE.+
VCC  (via drill 0.3)
  Top 0.254: v41,23.6 46.2,23.6 | v45,28.4 46,28.4 | 46,29 46,28.4 | v34.6,33.8 34.6,39.2 37.6,42.2 | 45,18.25 45.2,18.95 45.45,19.7 45.65,20.55 45.85,21.6 46,22.6 46.2,23.6 | 46.2,23.6 46.2,26.75 46,28.4 | 41.3,39 41.2,38.95 39.6,40.55 38.5,41.5 37.6,42.2 | 37.6,42.2 36.8,42.75 36,43.25 35.1,43.8 33.8,44.45 32.65,44.95 32.1,45.2 31,45.5 29.75,45.75 27.8,46.1 25.9,46.25 23.75,46.2 21.1,46 | 11.2,41.1 10,39.9 8.75,38.35 7.3,36.5 6.45,34.9 5.2,31.9 4.35,28.75 4.2,27 4.15,24.5 4.5,21.25
  Top 0.305: v5.4,27 4.2,27
  Top 0.406: 1.1 4.5,21.25 arc-210 45,18.25 8.1 | 2.1 5.2,31.9 | 3.1 11.2,41.1 | 5.1 32.1,45.2 | 4.1 21.1,46 | 6.1 41.3,39 | 7.1 46,29
  Bottom 0.254: U3.5 v41,23.6 | C24.SMD+ 44,28.4 v45,28.4 | IC1.4 41.95,29.65 41,30.6 38.8,30.6 37.5,31.9 C27.SMD+ 34.6,32.05 v34.6,33.8
  Bottom 0.305: SPK1.- 5.4,27.5 v5.4,27
  Bottom 0.406: U3.5 41,21.5 40.05,20.55 U1.1 38.15,19.8 C17.SMD+ 37.95,17.55 D9.C | C24.SMD+ D12.C 42.25,29.5 IC1.4 | C27.SMD+ 29.05,32.05 SW1.5
  pour Bottom (rank 2, no thermals): 43.2,26.2 43.2,27.7 42.4,28.5 41.6,28.5 41.6,29.6 40.8,30.4 36.1,30.4 34.7,31.8 30.5,31.8 29.7,31 28.5,31 28.1,31.4 28.1,32.6 28.5,33 29.7,33 31,34.3 35,34.3 36.5,32.8 38.3,32.8 38.4,32.7 38.4,31.4 39,30.8 41.1,30.8 41.8,30.1 44.4,30.1 45.5,29 45.5,28 44.9,27.4 44.9,26.2
  pour Bottom (rank 2, no thermals): 37.5,17.1 37.3,17.3 37.3,20.8 39.8,20.8 40.6,21.6 40.6,23.9 40.7,24 41.3,24 41.4,23.9 41.4,20.4 40.8,20.4 40.5,20.1 40.5,19.1 38.9,19.1 38.7,18.9 38.7,17.3 38.5,17.1

### Text on the board
tPlace: Stethoscope v1.0 / Pierre CHARLIER